# EasyEDA schematic SCH_Victron-Orion-DC-DC-Charger-Cooling-Fan-Controller_2025-03-19.json
TITLE: Victron Orion DC-DC Charger Cooling Fan Controller; REV: 1.2; Date: 2025-03-17; Sheet: 1/1; Drawn By: daipie64
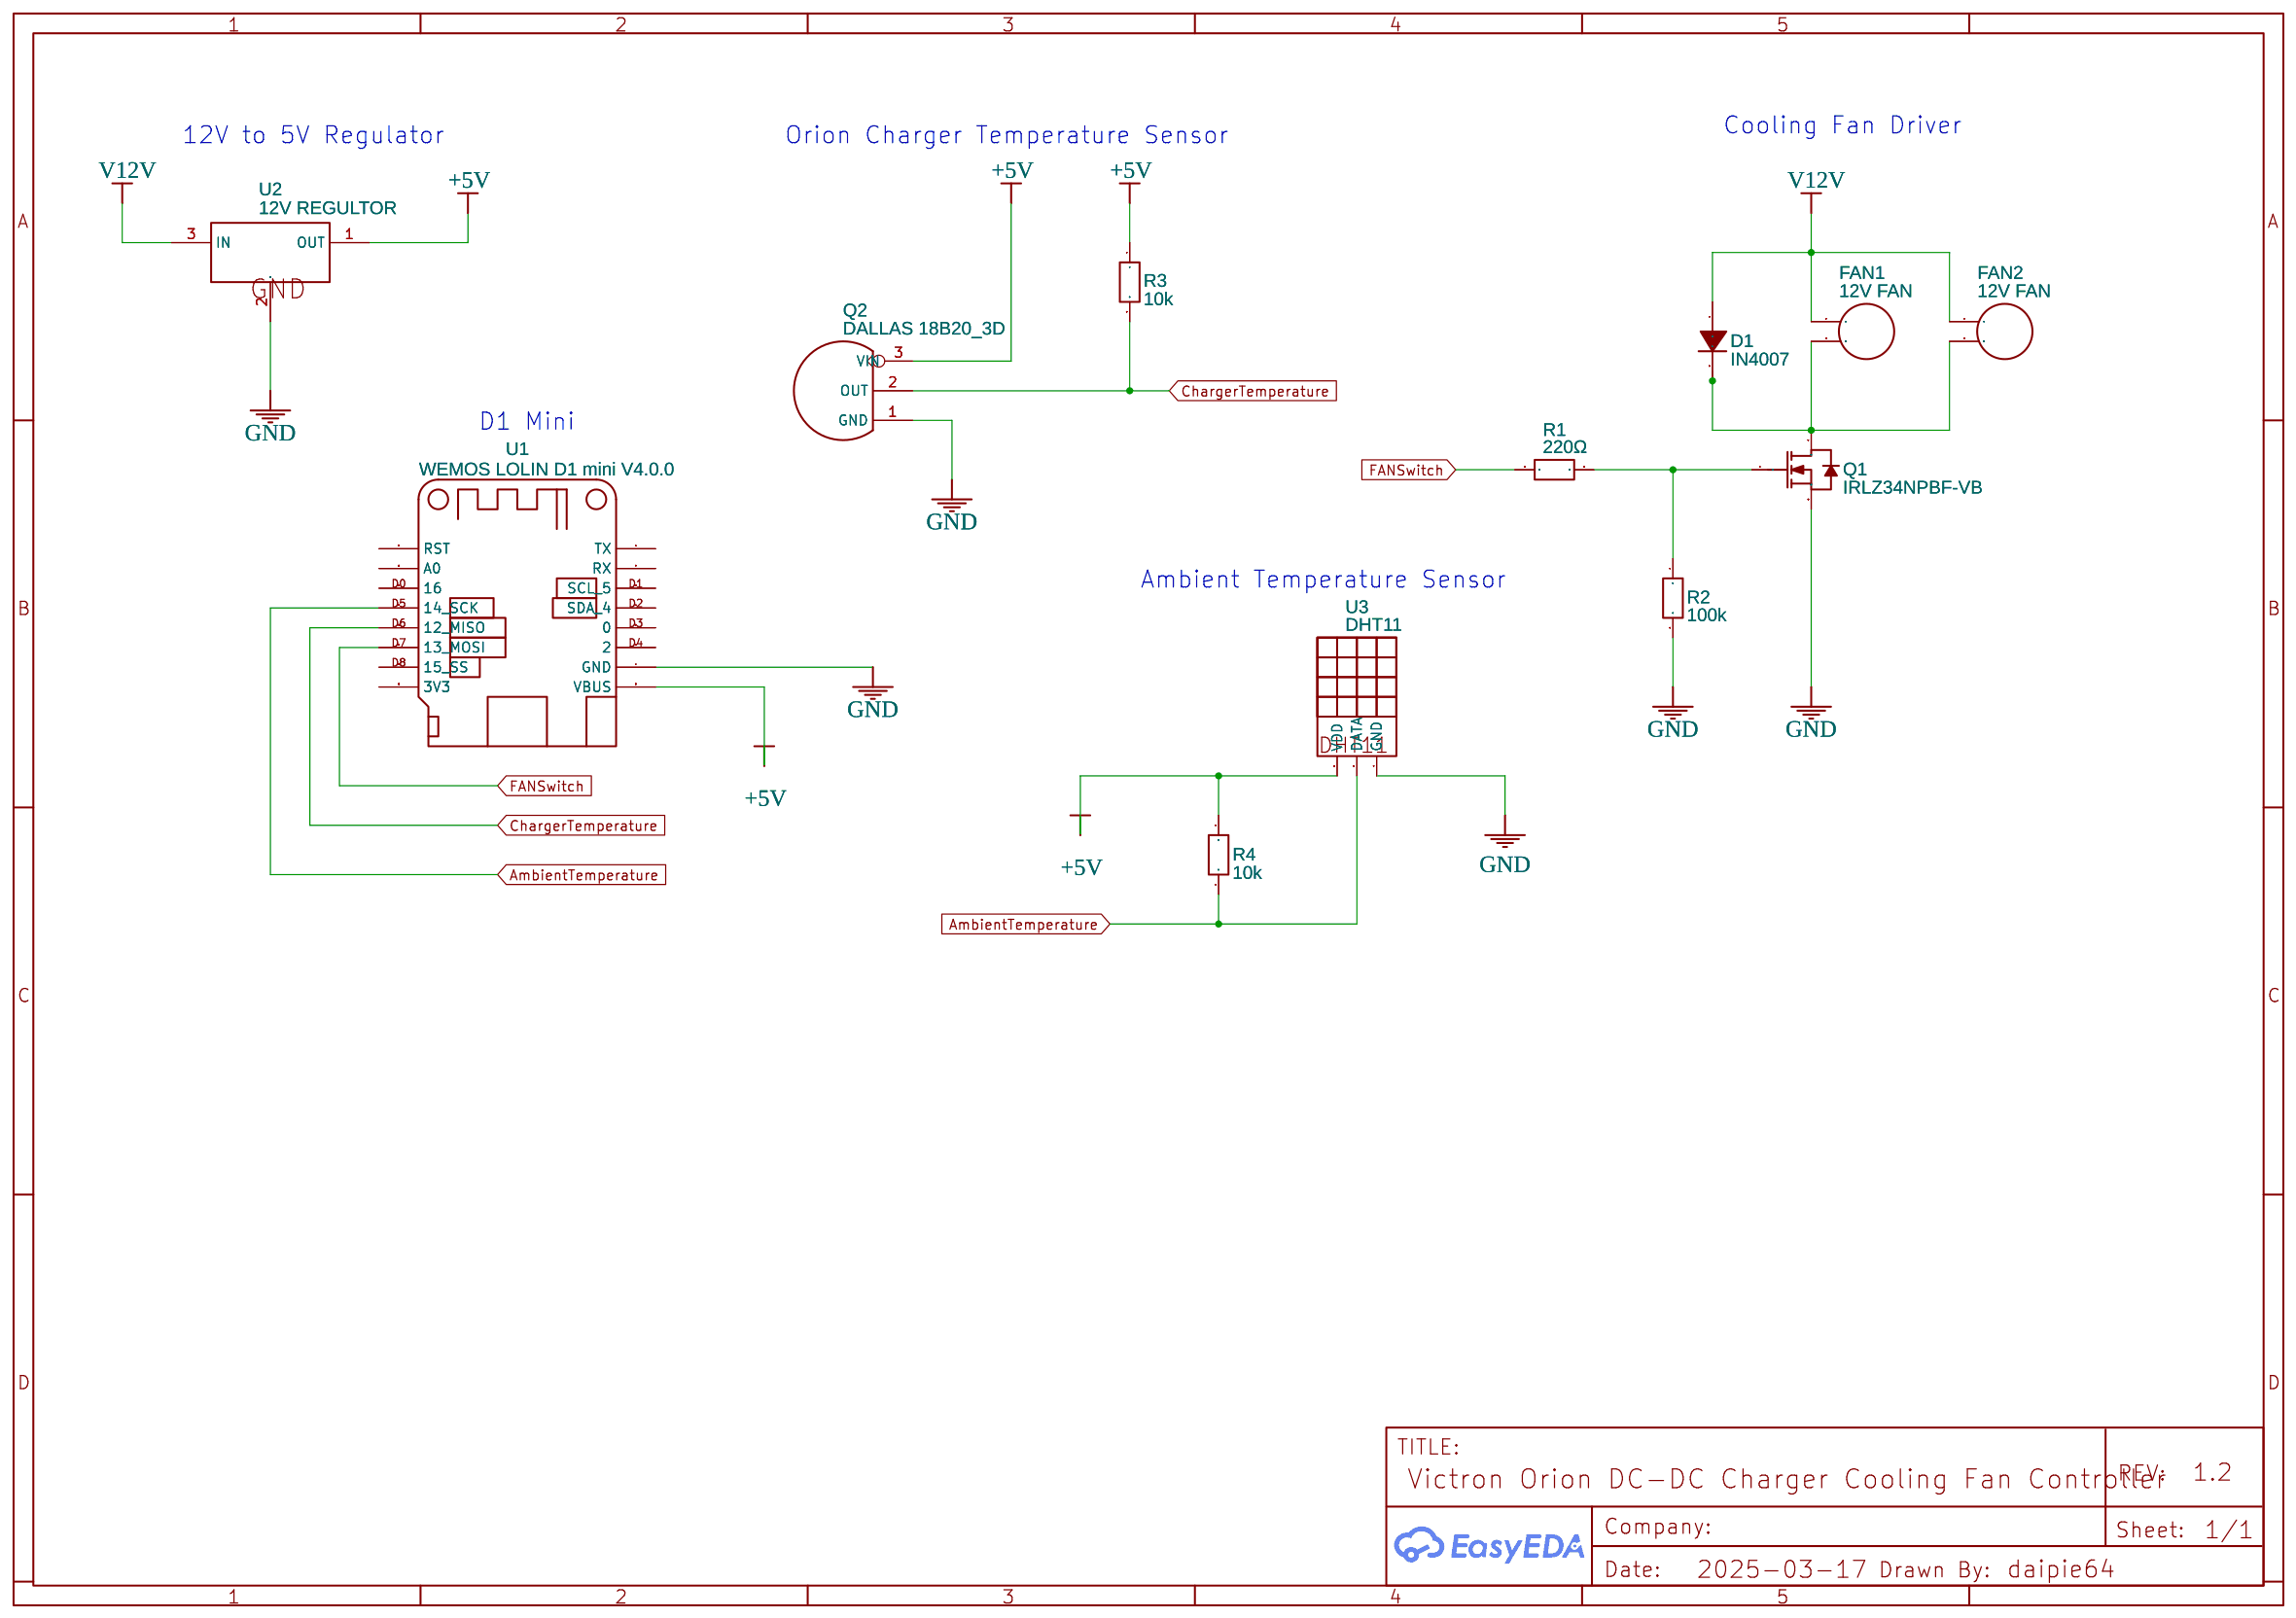
[diagram p0: schematic sheet]

## Parts
D1  IN4007  [DIODE_1N4007]
FAN1  12V FAN  [FAN]
FAN2  12V FAN  [FAN]
Q1  IRLZ34NPBF-VB  [TO-220AB-3_L10.4-W4.6-P2.54-L]
Q2  DALLAS 18B20_3D  [TO-92 AMMO]
R1  220Ω  [R0603]
R2  100k  [R0603]
R3  10k  [R0603]
R4  10k  [R0603]
U1  WEMOS LOLIN D1 mini V4.0.0  [WEMOS LOLIN D1 MINI V4.0.0_FOOTPRINT]
U2  12V REGULTOR  [SOT-89-3_L4.5-W2.5-P1.50-LS4.2-BR]
U3  DHT11  [DHT11]

## Library data of the parts
D1 = 1N4007: Manufacturer: ST(先科); Supplier Part: C106903; JLCPCB Part Class: Extended Part; Contributor: revano
FAN1 FAN2 = FAN COPY: Contributor: Tomvegdom
Q1 = IRLZ34NPBF-VB: Contributor: lcsc; Supplier: LCSC; Supplier Part: C7429062; Manufacturer: VBsemi(微碧半导体)
Q2 = DALLAS 18B20_3D: Dallas 1-wire Temp Sensor; Supplier Part: 314010014; Supplier: SeeedStudio; Manufacturer Part: DS18B20
R1-R4 = R_0603_EU: Contributor: LCEDA_Lib
U1 = WEMOS LOLIN D1 mini V4.0.0: Contributor: codec_xyz
U2 = 7805(SOT-89): Supplier: LCSC; Manufacturer: CJ; Manufacturer Part: CJ78L05; image: //image.lceda.cn/szlcsc/C2079.jpg; Supplier Part: C2079; Paste Type: expand; Contributor: LCEDA_Lib
U3 = DHT11: DIP Tem-Hum Sensor; Supplier Part: 314010000; Supplier: SeeedStudio; Contributor: ismifaizul

## Nets
+5V: Q2.3(VIN) R3.1 R4.1 U1.8(VBUS) U2.1(OUT) U3.3(VDD)
GND: Q1.3(S) Q2.1(GND) R2.2 U1.7(GND) U2.2(GND) U3.1(GND)
V12V: D1.1(A) FAN1.1 FAN2.1 U2.3(IN)
AmbientTemperature: R4.2 U1.12(14 SCK) U3.2(DATA)
ChargerTemperature: Q2.2(OUT) R3.2 U1.13(12 MISO)
FANSwitch: R1.1 U1.14(13 MOSI)
Net-(D1-2): D1.2(K) FAN1.2 FAN2.2 Q1.2(D)
Net-(Q1-1): Q1.1(G) R1.2 R2.1

Not connected (* = marked no-connect by the designer): U1 1(TX) 2(RX) 3(SCL 5) 4(SDA 4) 5(0) 6(2) 9(RST) 10(A0) 11(16) 15(15 SS) 16(3V3)

## Notes on the sheet
- Cooling Fan Driver
- 12V to 5V Regulator
- Orion Charger Temperature Sensor
- D1 Mini
- Ambient Temperature Sensor
